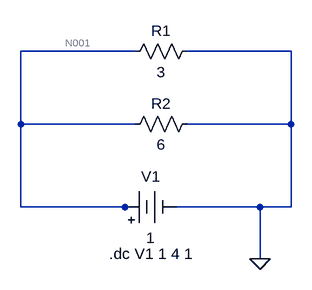
[diagram p0: schematic Assignment 1 parallel.asc]
Assignment 1 parallel.asc, the LTspice schematic file:
Version 4
SHEET 1 880 680
WIRE 144 80 -32 80
WIRE 384 80 224 80
WIRE -32 192 -32 80
WIRE 144 192 -32 192
WIRE 384 192 384 80
WIRE 384 192 224 192
WIRE -32 320 -32 192
WIRE 128 320 -32 320
WIRE 144 320 128 320
WIRE 336 320 208 320
WIRE 384 320 384 192
WIRE 384 320 336 320
WIRE 336 400 336 320
FLAG 336 400 0
SYMBOL res 128 96 R270
WINDOW 0 32 56 VTop 2
WINDOW 3 0 56 VBottom 2
SYMATTR InstName R1
SYMATTR Value 3
SYMBOL res 128 208 R270
WINDOW 0 32 56 VTop 2
WINDOW 3 0 56 VBottom 2
SYMATTR InstName R2
SYMATTR Value 6
SYMBOL Misc\\battery 112 320 R270
WINDOW 0 32 56 VTop 2
WINDOW 3 -32 56 VBottom 2
WINDOW 123 0 0 Left 0
WINDOW 39 0 0 Left 0
SYMATTR InstName V1
SYMATTR Value 1
TEXT 104 392 Left 2 !.dc V1 1 4 1

The netlist it stands for:
* Assignment 1 parallel.asc
R1 N001 0 3
R2 N001 0 6
V1 N001 0 1
.dc V1 1 4 1
.backanno
.end

* Results of the author's LTspice run, read from the files saved beside the schematic
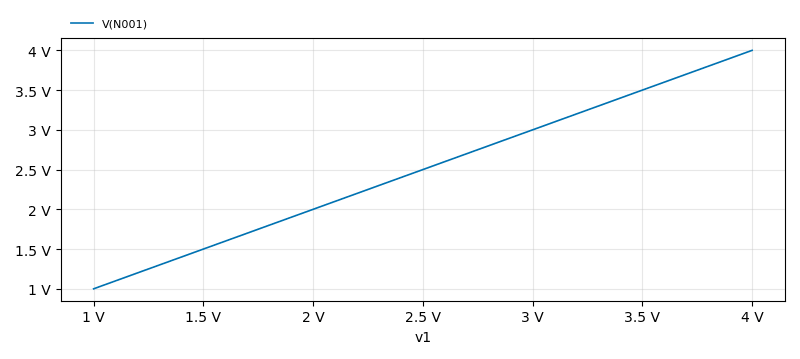
[diagram p1: DC transfer characteristic of Assignment 1 parallel.asc, plotted from the saved traces]
* DC transfer characteristic, 1 run:
*   V(N001): 1 V at v1=1 V, 4 V at v1=4 V, min 1 V, max 4 V